# Altium schematic sheet MMC.SchDoc
size A2
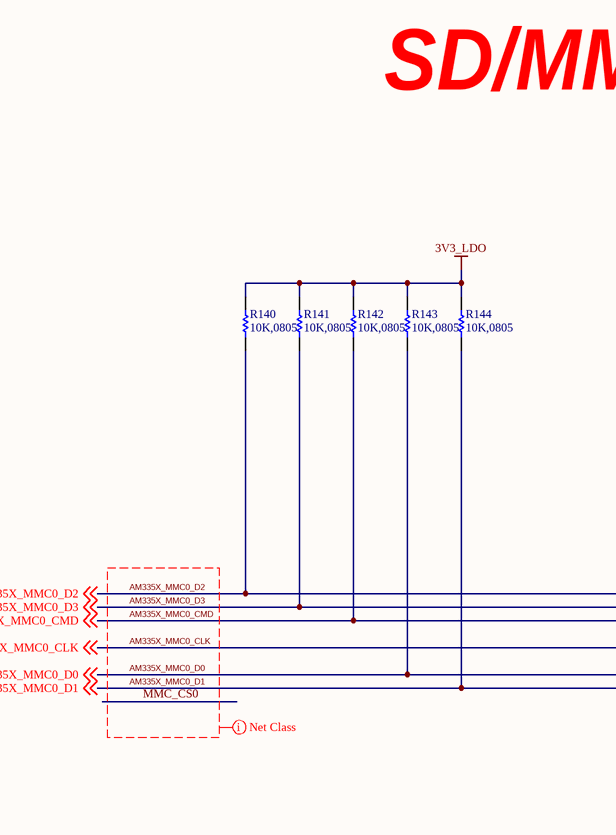
[diagram p0: MMC.SchDoc, left]
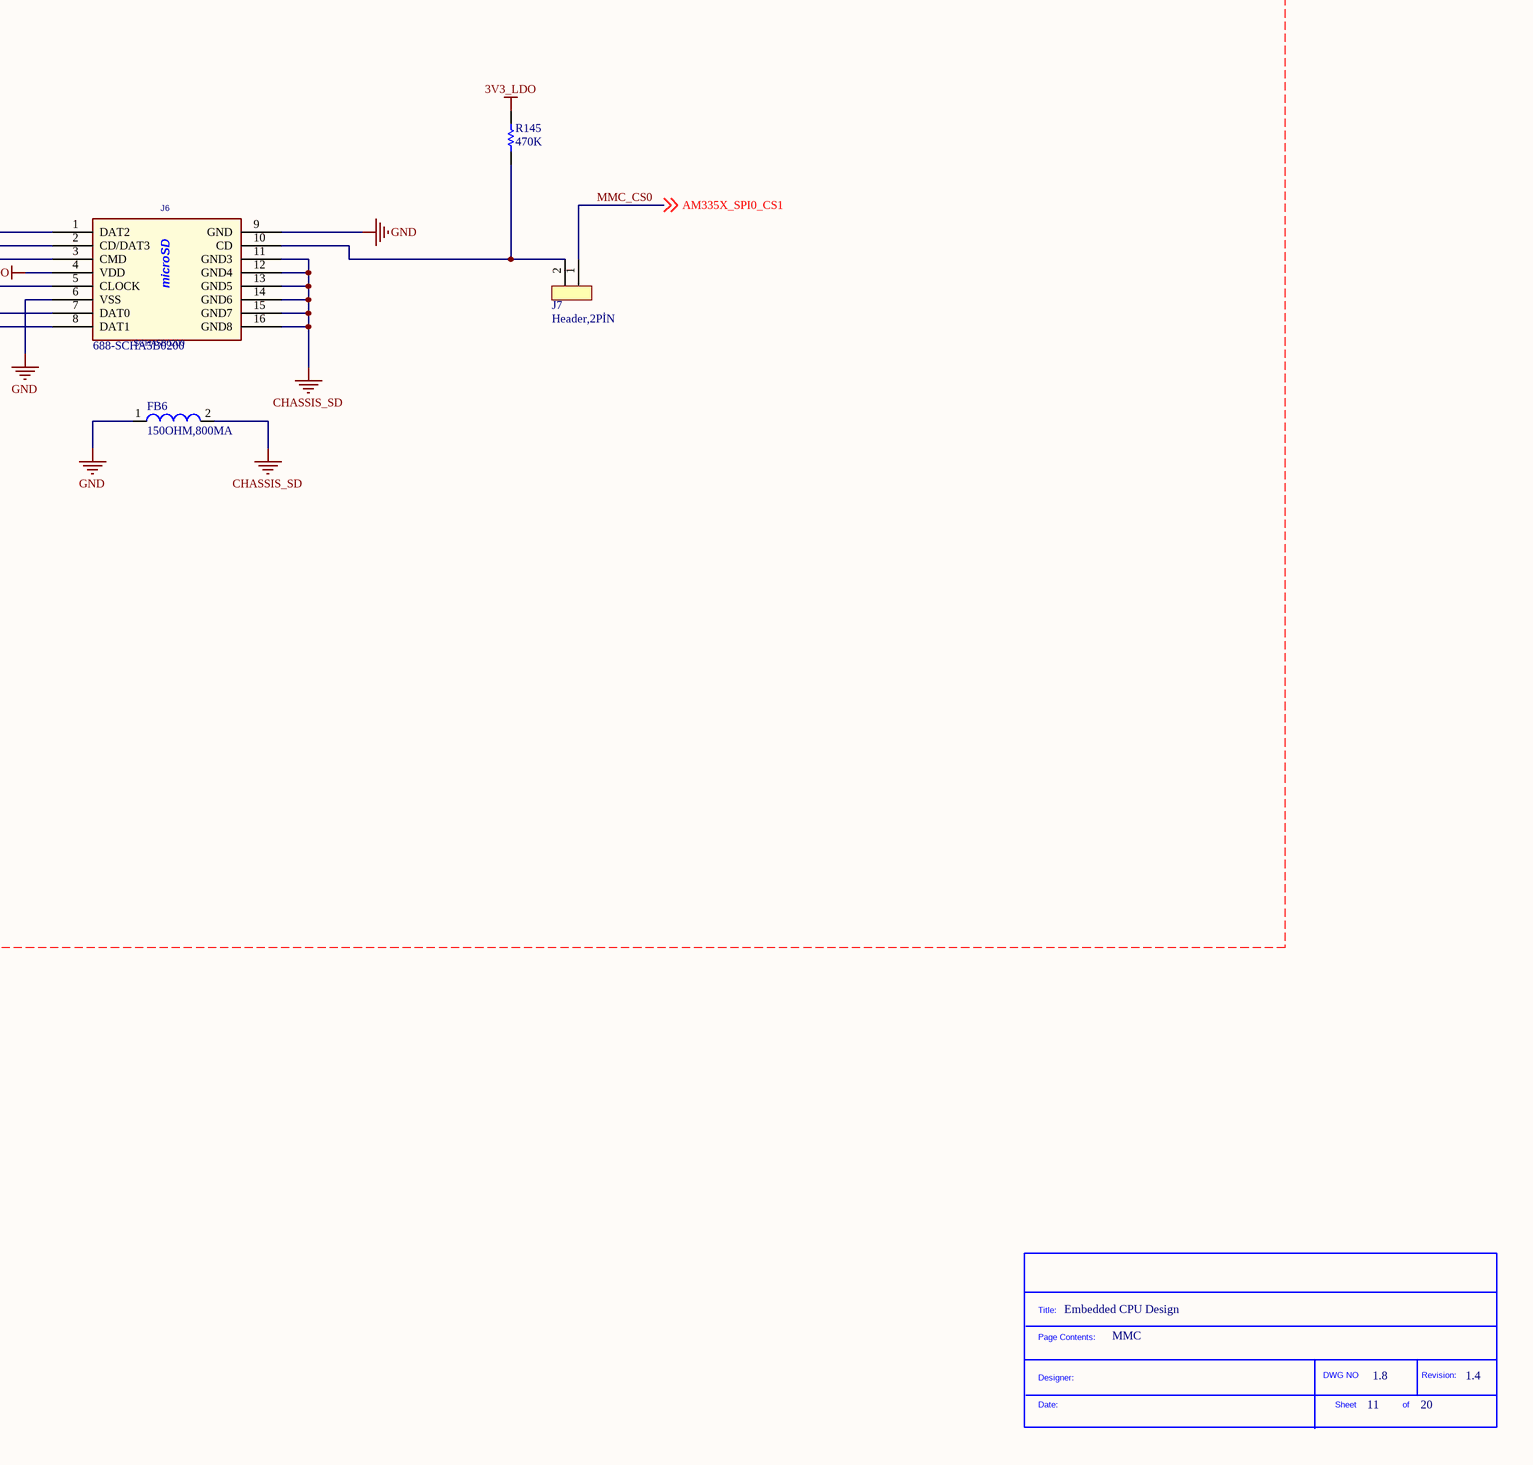
[diagram p1: MMC.SchDoc, right]

## Parts
*?  SDTitleBlock  (value not drawn)  (graphical)
FB6  150OHM,800MA  [0805]
J6  SCHA5B0200  Supplier Part Number 1: 688-SCHA5B0200  [SD-MICRO-SCHA5B0300]
J7  Header,2PİN  [HEADER,2PİN]
R140  10K,0805  [0805]
R141  10K,0805  [0805]
R142  10K,0805  [0805]
R143  10K,0805  [0805]
R144  10K,0805  [0805]
R145  470K  [0805]

## Nets
3V3_LDO: J6.4(VDD) R140.2 R141.2 R142.2 R143.2 R144.2 R145.2
CHASSIS_SD: FB6.2 J6.11(GND3) J6.12(GND4) J6.13(GND5) J6.14(GND6) J6.15(GND7) J6.16(GND8)
GND: FB6.1 J6.6(VSS) J6.9(GND)
AM335X_MMC0_CLK: J6.5(CLOCK) ; off-sheet AM335X_MMC0_CLK
AM335X_MMC0_CMD: J6.3(CMD) R142.1 ; off-sheet AM335X_MMC0_CMD
AM335X_MMC0_D0: J6.7(DAT0) R143.1 ; off-sheet AM335X_MMC0_D0
AM335X_MMC0_D1: J6.8(DAT1) R144.1 ; off-sheet AM335X_MMC0_D1
AM335X_MMC0_D2: J6.1(DAT2) R140.1 ; off-sheet AM335X_MMC0_D2
AM335X_MMC0_D3: J6.2(CD/DAT3) R141.1 ; off-sheet AM335X_MMC0_D3
MMC_CS0: J7.1 ; off-sheet AM335X_SPI0_CS1  [also labelled AM335X_SPI0_CS1]
NetJ6_10: J6.10(CD) J7.2 R145.1

## Layout directives
net class MMC: AM335X_MMC0_CLK, AM335X_MMC0_CMD, AM335X_MMC0_D0, AM335X_MMC0_D1, AM335X_MMC0_D2, AM335X_MMC0_D3, MMC_CS0
net class MMC_P: 3V3_LDO, AM335X_MMC0_CLK, AM335X_MMC0_CMD, AM335X_MMC0_D0, AM335X_MMC0_D1, AM335X_MMC0_D2, AM335X_MMC0_D3, AM335X_SPI0_CS1, CHASSIS_SD, GND, MMC_CS0

## Notes on the sheet
- SD/MMC Connector
- Embedded CPU Design
- MMC
- 11
- 1.8
- 20
- 1.4
- (in symbol SDTitleBlock) Title:; Page Contents:; DWG NO; Revision:; Designer:; Date:; Sheet; of

## Library data of the parts
FB6 = 150OHM,800MA: FERRITE 800MA 150 OHM 0805 SMD; Manufacturer: Laird-Signal Integrity Products; Manufacturer Part Number: LI0805H151R-10; Impedance @ Frequency: 150 Ohm @ 100MHz; DC Resistance (DCR): 150 mOhm Max; Filter Type: Differential Mode - Single; Supplier 1: Digi-Key; RoHS: RoHS Compliant; Category: Filters; Stock 1: 418596; Pricing 1: 1=0.1, 10=0.07, 25=0.064, 50=0.0574, 100=0.0421, 250=0.03064, 500=0.02808, 1000=0.02424 (USD); Packaging: Cut Tape (CT); Current Rating: 800mA; Package / Case: 0805 (2012 Metric); Mounting Type: Surface Mount; Height (Max): 0.043" (1.10mm); Size / Dimension: 0.079" L x 0.049" W (2.00mm x 1.25mm); ComponentLink1URL: http://www.lairdtech.com/WorkArea/linkit.aspx?LinkIdentifier=id&ItemID=4912; ComponentLink1Description: http://www.lairdtech.com/WorkArea/linkit.aspx?LinkIdentifier=id&ItemID=4912; Supplier Part Number 1: 240-2384-1-ND
J6 = Conn_microSD_8: TIIntPartnumber: 2C0102; Mfr: ALPS; PartName: Conn_microSD_SCHA5B0200; DescriptiveText: Connector compact low-profile Push Type Micro SD; Cost10K: x.00; Vendor: Mouser; Number of Contacts: 8; Voltage Rating: 500 VAC; Insertion - Extraction Style: Push-Push; Mating Cycles: 10 k; Cost100: x.00; MfrNum: SCHA5B0200; Supplier 1: Mouser; Manufacturer: ALPS; Manufacturer Part Number: SCHA5B0200; RoHS: RoHS Compliant; Category: Memory Card Connectors; Features: With switch; Height: 15.25 mm; Length: 13.825 mm; Mounting Type: Reverse; Number of Rows: 1; Orientation: Horizontal; Packaging: Reel; Product: Card Connectors; Termination Style: SMD; Brand: ALPS; Mounting Style: -; Card Type: microSD; Standard Pack Qty: 1500; RoHS - Mouser: Y; Minimum Order Quantity: 1; Reeling: True; ComponentLink1URL: http://www.mouser.com/ds/2/15/SCHA-186221.pdf; ComponentLink1Description: http://www.mouser.com/ds/2/15/SCHA-186221.pdf; Stock 1: 13412; Pricing 1: 1=1.62, 25=1.46, 50=1.35, 100=1.31, 500=1.22, 1000=1.18, 1500=1.14, 4500=1.07, 9000=1.04 (AUD)
R140-R144 = 10K,0805: BOURNS - CR0805-FX-1002GLF - RESISTOR, 10K, 0.125W, 1%; Product Range: BOURNS - CR Series; Resistance: 10; Power Rating: 125; Resistor Case Style: 0805 [2012 Metric]; Resistor Element Material: Thick Film; Temperature Coefficient: ± 100; Voltage Rating: 150; SVHC: No SVHC (16-Jun-2014); Resistor Mounting: SMD<!--FANDB--><div class="features-and-benefits-container"></div>; Power (Watts): 0.125W, 1/8W; Supplier 1: Digi-Key; Manufacturer: BOURNS; Manufacturer Part Number: CR0805-FX-1002GLF; RoHS: YES; Stock 1: 1116166; Pricing 1: 1=0.1, 10=0.029, 50=0.0162, 100=0.0123, 250=0.00912, 500=0.00672, 1000=0.00448, 2500=0.00378 (USD); Resistance Tolerance: ± 1%; Packaging: Cut Tape; MSL: MSL 1 - Unlimited; ComponentLink1URL: http://www.farnell.com/datasheets/1845293.pdf; ComponentLink1Description: http://www.farnell.com/datasheets/1845293.pdf; Supplier Part Number 1: RMCF0805FT10K0CT-ND; Category: Resistors; Resistance (Ohms): 10k; Tolerance: ±1%; Composition: Thick Film; Features: -; Operating Temperature: -55°C ~ 155°C; Package / Case: 0805 (2012 Metric); Supplier Device Package: 0805; Size / Dimension: 0.079" L x 0.049" W (2.00mm x 1.25mm); Height: 0.026" (0.65mm); Number of Terminations: 2; ComponentLink2URL: http://www.seielect.com/Catalog/SEI-RMCF_RMCP.pdf; ComponentLink2Description: http://www.seielect.com/Catalog/SEI-RMCF_RMCP.pdf
R145 = 470K: RES 470K OHM 1/8W 1% 0805 SMD; Manufacturer: Rohm Semiconductor; Manufacturer Part Number: MCR10ERTF4703; Power (Watts): 0.125W, 1/8W; Temperature Coefficient: ±100ppm/°C; Supplier 1: Digi-Key; RoHS: RoHS Compliant; Category: Resistors; Stock 1: 10000; Pricing 1: 5000=0.00319, 10000=0.00277, 25000=0.00244, 50000=0.00223, 125000=0.00219 (USD); Packaging: Tape & Reel (TR); Resistance (Ohms): 470k; Tolerance: ±1%; Composition: Thick Film; Features: -; Package / Case: 0805 (2012 Metric); Supplier Device Package: 0805 (2012 Metric); Size / Dimension: 0.079" L x 0.049" W (2.00mm x 1.25mm); Height: 0.024" (0.60mm); Number of Terminations: 2; ComponentLink1URL: http://rohmfs.rohm.com/en/products/databook/datasheet/passive/resistor/chip_resistor/mcr_g.pdf; ComponentLink1Description: http://rohmfs.rohm.com/en/products/databook/datasheet/passive/resistor/chip_resistor/mcr_g.pdf; Supplier Part Number 1: RHM470KCHTR-ND